# Altium schematic sheet main.SchDoc
size A4; SheetNumber: 1; SheetTotal: 4; SPICEModelCacheVDPEFNXI: <root> / <DocumentId>VDPEFNXI</DocumentId> / </root>
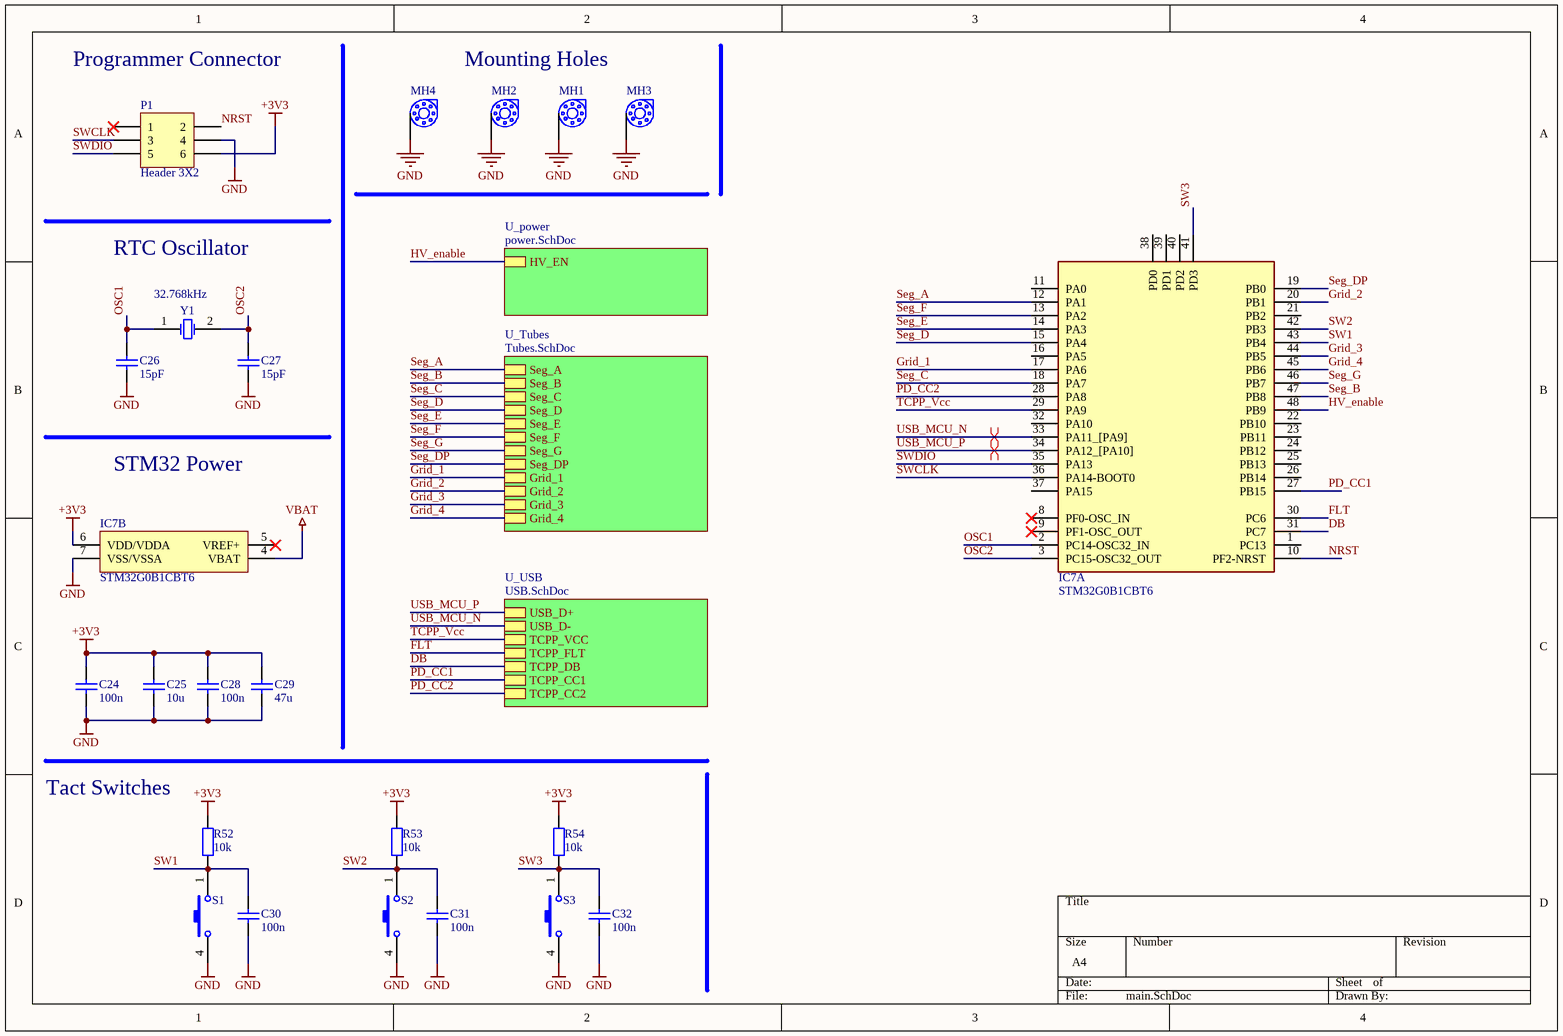
[diagram p0: main.SchDoc]

## Parts
C24  100n  [1608[0603]]
C25  10u  [1608[0603]]
C26  15pF  [1608[0603]]
C27  15pF  [1608[0603]]
C28  100n  [1608[0603]]
C29  47u  [1608[0603]]
C30  100n  [1608[0603]]
C31  100n  [1608[0603]]
C32  100n  [1608[0603]]
IC7  STM32G0B1CBT6  [QFP50P900X900X160-48N]  (parts A,B of 2)
MH1  HOLE 2mm  [Hole]  (value not drawn)  (no BOM)
MH2  HOLE 2mm  [Hole]  (value not drawn)  (no BOM)
MH3  HOLE 2mm  [Hole]  (value not drawn)  (no BOM)
MH4  HOLE 2mm  [Hole]  (value not drawn)  (no BOM)
P1  Header 3X2  [HDR2X3]
R52  10k  [J1-0603]
R53  10k  [J1-0603]
R54  10k  [J1-0603]
S1  PTS647SK70SMTR2N_LFS  [PTS647SK70SMTR2NLFS]  (value not drawn)
S2  PTS647SK70SMTR2N_LFS  [PTS647SK70SMTR2NLFS]  (value not drawn)
S3  PTS647SK70SMTR2N_LFS  [PTS647SK70SMTR2NLFS]  (value not drawn)
Y1  32.768kHz  [ABS06N32768kHzT]

## Sub-sheets
U_power = power.SchDoc: HV_EN
U_Tubes = Tubes.SchDoc: Seg_A, Seg_B, Seg_C, Seg_D, Seg_E, Seg_F, Seg_G, Seg_DP, Grid_1, Grid_2, Grid_3, Grid_4
U_USB = USB.SchDoc: TCPP_VCC, TCPP_FLT, TCPP_DB, TCPP_CC1, TCPP_CC2, USB_D+, USB_D-

## Nets
+3V3: C24.2 C25.2 C28.2 C29.2 IC7.6(VDD/VDDA) P1.6 R52.2 R53.2 R54.2
GND: C24.1 C25.1 C26.1 C27.1 C28.1 C29.1 C30.1 C31.1 C32.1 IC7.7(VSS/VSSA) MH1.0(GND) MH2.0(GND) MH3.0(GND) MH4.0(GND) P1.4 S1.4(COM_2) S2.4(COM_2) S3.4(COM_2)
VBAT: IC7.4(VBAT)
DB: IC7.31(PC7) ; sheet U_USB/TCPP_DB
FLT: IC7.30(PC6) ; sheet U_USB/TCPP_FLT
Grid_1: IC7.17(PA6) ; sheet U_Tubes/Grid_1
Grid_2: IC7.20(PB1) ; sheet U_Tubes/Grid_2
Grid_3: IC7.44(PB5) ; sheet U_Tubes/Grid_3
Grid_4: IC7.45(PB6) ; sheet U_Tubes/Grid_4
HV_enable: IC7.48(PB9) ; sheet U_power/HV_EN
NRST: IC7.10(PF2-NRST) P1.2
OSC1: C26.2 IC7.2(PC14-OSC32_IN) Y1.1
OSC2: C27.2 IC7.3(PC15-OSC32_OUT) Y1.2
PD_CC1: IC7.27(PB15) ; sheet U_USB/TCPP_CC1
PD_CC2: IC7.28(PA8) ; sheet U_USB/TCPP_CC2
Seg_A: IC7.12(PA1) ; sheet U_Tubes/Seg_A
Seg_B: IC7.47(PB8) ; sheet U_Tubes/Seg_B
Seg_C: IC7.18(PA7) ; sheet U_Tubes/Seg_C
Seg_D: IC7.15(PA4) ; sheet U_Tubes/Seg_D
Seg_DP: IC7.19(PB0) ; sheet U_Tubes/Seg_DP
Seg_E: IC7.14(PA3) ; sheet U_Tubes/Seg_E
Seg_F: IC7.13(PA2) ; sheet U_Tubes/Seg_F
Seg_G: IC7.46(PB7) ; sheet U_Tubes/Seg_G
SW1: C30.2 IC7.43(PB4) R52.1 S1.1(NO_1)
SW2: C31.2 IC7.42(PB3) R53.1 S2.1(NO_1)
SW3: C32.2 IC7.41(PD3) R54.1 S3.1(NO_1)
SWCLK: IC7.36(PA14-BOOT0) P1.3
SWDIO: IC7.35(PA13) P1.5
TCPP_Vcc: IC7.29(PA9) ; sheet U_USB/TCPP_VCC
USB_MCU_N: IC7.33(PA11_[PA9]) ; sheet U_USB/USB_D-
USB_MCU_P: IC7.34(PA12_[PA10]) ; sheet U_USB/USB_D+

Not connected (* = marked no-connect by the designer): IC7 1(PC13) 5(VREF+)* 8(PF0-OSC_IN)* 9(PF1-OSC_OUT)* 11(PA0) 16(PA5) 21(PB2) 22(PB10) 23(PB11) 24(PB12) 25(PB13) 26(PB14) 32(PA10) 37(PA15) 38(PD0) 39(PD1) 40(PD2); P1 1*

## Layout directives
differential pair: USB_MCU_N, USB_MCU_P

## Notes on the sheet
- Programmer Connector
- Mounting Holes
- RTC Oscillator
- STM32 Power
- (near R52) Tact Switches

## Library data of the parts
C24-C32 = Cap: Capacitor; Value: 100pF; Published: 8-Jun-2000; LatestRevisionDate: 17-Jul-2002; LatestRevisionNote: Re-released for DXP Platform.; PackageReference: RAD-0.3; Publisher: Altium Limited; PackageDescription: Radial Cap, Thru-Hole; 2 Leads; 0.3 in Pin Spacing
IC7 = STM32G0B1CBT6: Integrated Circuit; Manufacturer_Name: STMicroelectronics; Datasheet Link: https://www.st.com/resource/en/datasheet/stm32g0b1cb.pdf; Height: 1.6mm; Manufacturer_Part_Number: STM32G0B1CBT6; Mouser Part Number: 511-STM32G0B1CBT6; Mouser Price/Stock: https://www.mouser.co.uk/ProductDetail/STMicroelectronics/STM32G0B1CBT6?qs=CiayqK2gdcKaQJ%2FcS3grXw%3D%3D; Arrow Part Number: STM32G0B1CBT6; Arrow Price/Stock: https://www.arrow.com/en/products/stm32g0b1cbt6/stmicroelectronics?utm_currency=USD&region=nac
MH1-MH4 = MOUNT_HOLE_2MM_CORNER
P1 = Header 3X2: Header, 3-Pin, Dual row; LatestRevisionDate: 17-Jul-2002; LatestRevisionNote: Re-released for DXP Platform.; Publisher: Altium Limited
R52-R54 = Res2: Resistor; Value: 1K; Published: 8-Jun-2000; LatestRevisionDate: 17-Jul-2002; LatestRevisionNote: Re-released for DXP Platform.; PackageReference: AXIAL-0.4; Publisher: Altium Limited; PackageDescription: Axial Device, Thru-Hole; 2 Leads; 0.4 in Pin Spacing
S1-S3 = PTS647SK70SMTR2N_LFS: Switch (4-Pin Push); Manufacturer_Name: C & K COMPONENTS; Manufacturer_Part_Number: PTS647SK70SMTR2N LFS; Datasheet Link: https://www.ckswitches.com/media/2567/pts647.pdf; Height: 7mm
Y1 = ABS06N-32.768kHz-T: Crystal or Oscillator; Manufacturer_Name: ABRACON; Datasheet Link: https://abracon.com/datasheets/ABS06N.pdf; Height: 0.6mm; Manufacturer_Part_Number: ABS06N-32.768kHz-T